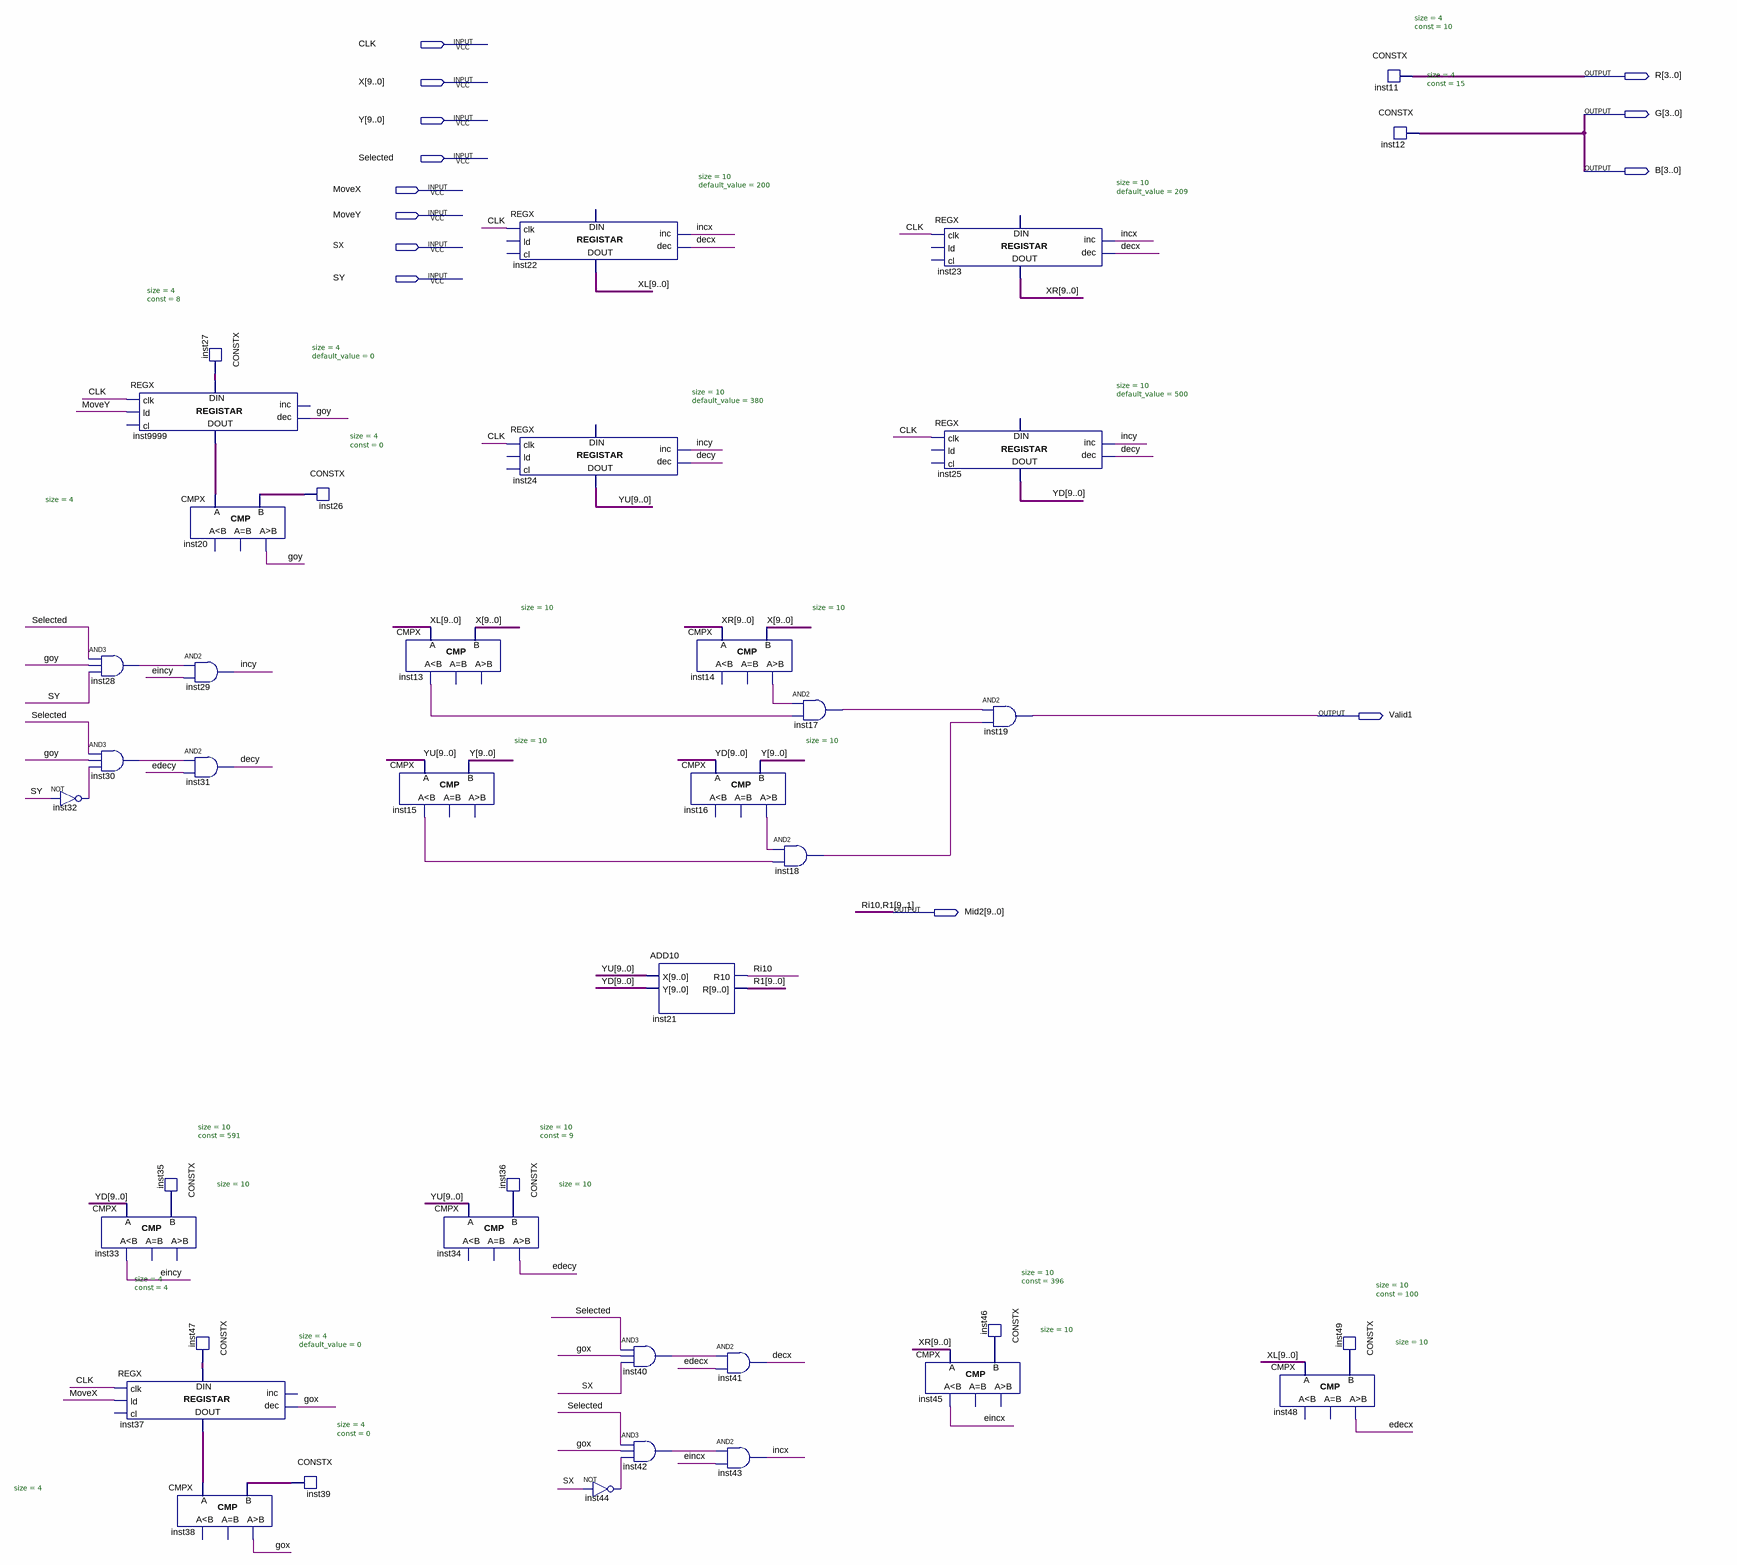
[diagram p0: schematic sheet]
// Quartus schematic Nap22.bdf as structural Verilog: 40 symbols, 13 pins
module Nap22 (
  input  CLK,
  input  [9:0] X,
  input  [9:0] Y,
  input  Selected,
  input  MoveX,
  input  MoveY,
  input  SX,
  input  SY,
  output [3:0] R,
  output [3:0] G,
  output [3:0] B,
  output Valid1,
  output [9:0] Mid2
);

  wire decx, decy, edecx, edecy, eincx, eincy, gox, goy, incx, incy, inst13_ls, inst14_gr, inst15_ls,
       inst16_gr, inst17_out, inst18_out, inst28_out, inst30_out, inst32_out, inst40_out, inst42_out,
       inst44_out;
  wire [0:0] R1;
  wire [3:0] inst26_data, inst27_data, inst37_data_out, inst39_data, inst47_data, inst9999_data_out;
  wire [9:0] inst35_data, inst36_data, inst46_data, inst49_data, XL, XR, YD, YU;

  not inst32 (inst32_out, SY);
  REGX #(.size(4), .default_value(0)) inst9999 (
    .clk(CLK), .ld(MoveY), .dec(goy), .data_in(inst27_data), .data_out(inst9999_data_out));  // open: cl, inc
  and inst28 (inst28_out, Selected, goy, SY);
  and inst30 (inst30_out, Selected, goy, inst32_out);
  CMPX #(.size(10)) inst33 (.A(YD), .B(inst35_data), .ls(eincy));  // open: eq, gr
  REGX #(.size(4), .default_value(0)) inst37 (
    .clk(CLK), .ld(MoveX), .dec(gox), .data_in(inst47_data), .data_out(inst37_data_out));  // open: cl, inc
  CMPX #(.size(4)) inst20 (.A(inst9999_data_out), .B(inst26_data), .gr(goy));  // open: ls, eq
  CONSTX #(.size(10), .\const (591)) inst35 (.data(inst35_data));
  CMPX #(.size(4)) inst38 (.A(inst37_data_out), .B(inst39_data), .gr(gox));  // open: ls, eq
  CONSTX #(.size(4), .\const (8)) inst27 (.data(inst27_data));
  and inst29 (incy, inst28_out, eincy);
  and inst31 (decy, inst30_out, edecy);
  CONSTX #(.size(4), .\const (4)) inst47 (.data(inst47_data));
  CONSTX #(.size(4), .\const (0)) inst26 (.data(inst26_data));
  CONSTX #(.size(4), .\const (0)) inst39 (.data(inst39_data));
  CMPX #(.size(10)) inst13 (.A(XL), .B(X), .ls(inst13_ls));  // open: eq, gr
  CMPX #(.size(10)) inst15 (.A(YU), .B(Y), .ls(inst15_ls));  // open: eq, gr
  CMPX #(.size(10)) inst34 (.A(YU), .B(inst36_data), .gr(edecy));  // open: ls, eq
  REGX #(.size(10), .default_value(200)) inst22 (
    .clk(CLK), .inc(incx), .dec(decx), .data_out(XL));  // open: ld, cl, data_in
  REGX #(.size(10), .default_value(380)) inst24 (
    .clk(CLK), .inc(incy), .dec(decy), .data_out(YU));  // open: ld, cl, data_in
  CONSTX #(.size(10), .\const (9)) inst36 (.data(inst36_data));
  not inst44 (inst44_out, SX);
  and inst40 (inst40_out, Selected, gox, SX);
  and inst42 (inst42_out, Selected, gox, inst44_out);
  CMPX #(.size(10)) inst14 (.A(XR), .B(X), .gr(inst14_gr));  // open: ls, eq
  CMPX #(.size(10)) inst16 (.A(YD), .B(Y), .gr(inst16_gr));  // open: ls, eq
  ADD10 inst21 (.X(YU), .Y(YD), .R10(Mid2[9]), .R({Mid2[8:0], R1[0]}));
  and inst41 (decx, inst40_out, edecx);
  and inst43 (incx, inst42_out, eincx);
  and inst18 (inst18_out, inst16_gr, inst15_ls);
  and inst17 (inst17_out, inst14_gr, inst13_ls);
  REGX #(.size(10), .default_value(209)) inst23 (
    .clk(CLK), .inc(incx), .dec(decx), .data_out(XR));  // open: ld, cl, data_in
  REGX #(.size(10), .default_value(500)) inst25 (
    .clk(CLK), .inc(incy), .dec(decy), .data_out(YD));  // open: ld, cl, data_in
  CMPX #(.size(10)) inst45 (.A(XR), .B(inst46_data), .ls(eincx));  // open: eq, gr
  and inst19 (Valid1, inst17_out, inst18_out);
  CONSTX #(.size(10), .\const (396)) inst46 (.data(inst46_data));
  CMPX #(.size(10)) inst48 (.A(XL), .B(inst49_data), .gr(edecx));  // open: ls, eq
  CONSTX #(.size(10), .\const (100)) inst49 (.data(inst49_data));
  CONSTX #(.size(4), .\const (10)) inst11 (.data(R));
  CONSTX #(.size(4), .\const (15)) inst12 (.data(B));

  assign G = B;

  // Other names for the same wires on the sheet: R1[9:1] = Mid2[8:0]; Ri10 = Mid2[9]
endmodule
